# Altium schematic sheet STM32-Mentor.SchDoc: STM32 Demo板子
size A3; Author: 陈林; SheetNumber: 1; SheetTotal: 1; SPICEModelCacheTDPMXVPD: <root> / <DocumentId>TDPMXVPD</DocumentId> / <CacheFrame Number="0"> / <Model Name="cap" Kind="MDL"> / <Text>*Default semiconductor capacitor / .MODEL CAP C()</Text> / </Model> / <Model Name="xtal" Kind="CKT"> / <Text>*Generic type:crystal pkg:HC33/51 / .SUBCKT XTAL 1 2 PARAMS: FREQ=1Meg RS=750 C=13pf Q=1000 / LX 1 3 {((Q*RS)/(6.2831852*FREQ))} IC=0.5M / CX 3 4 {(1/(Q*6.2831852*FREQ*RS))} / C0 1 2 {C} / RS 4 2 {RS} / .ENDS XTAL</Text> / </Model> / <Model Name="led0" Kind="MDL"> / <Text>*Typ INFRARED GaAs LED: Vf=1.2V Vr=5V If=40mA trr=3uS / *LED Pinout: 1=A, 2=K / .MODEL LED0 D (IS=93.5P RS=84M N=2.63 BV=5 IBV=10U / + CJO=2.97P VJ=.75 M=.333 TT=4.32U)</Text> / </Model> / <Model Name="pnp" Kind="MDL"> / <Text>*Default PNP BJT / *PNP Trans Pinout: C,B,E / .MODEL PNP PNP()</Text> / </Model> / </CacheFrame> / </root>
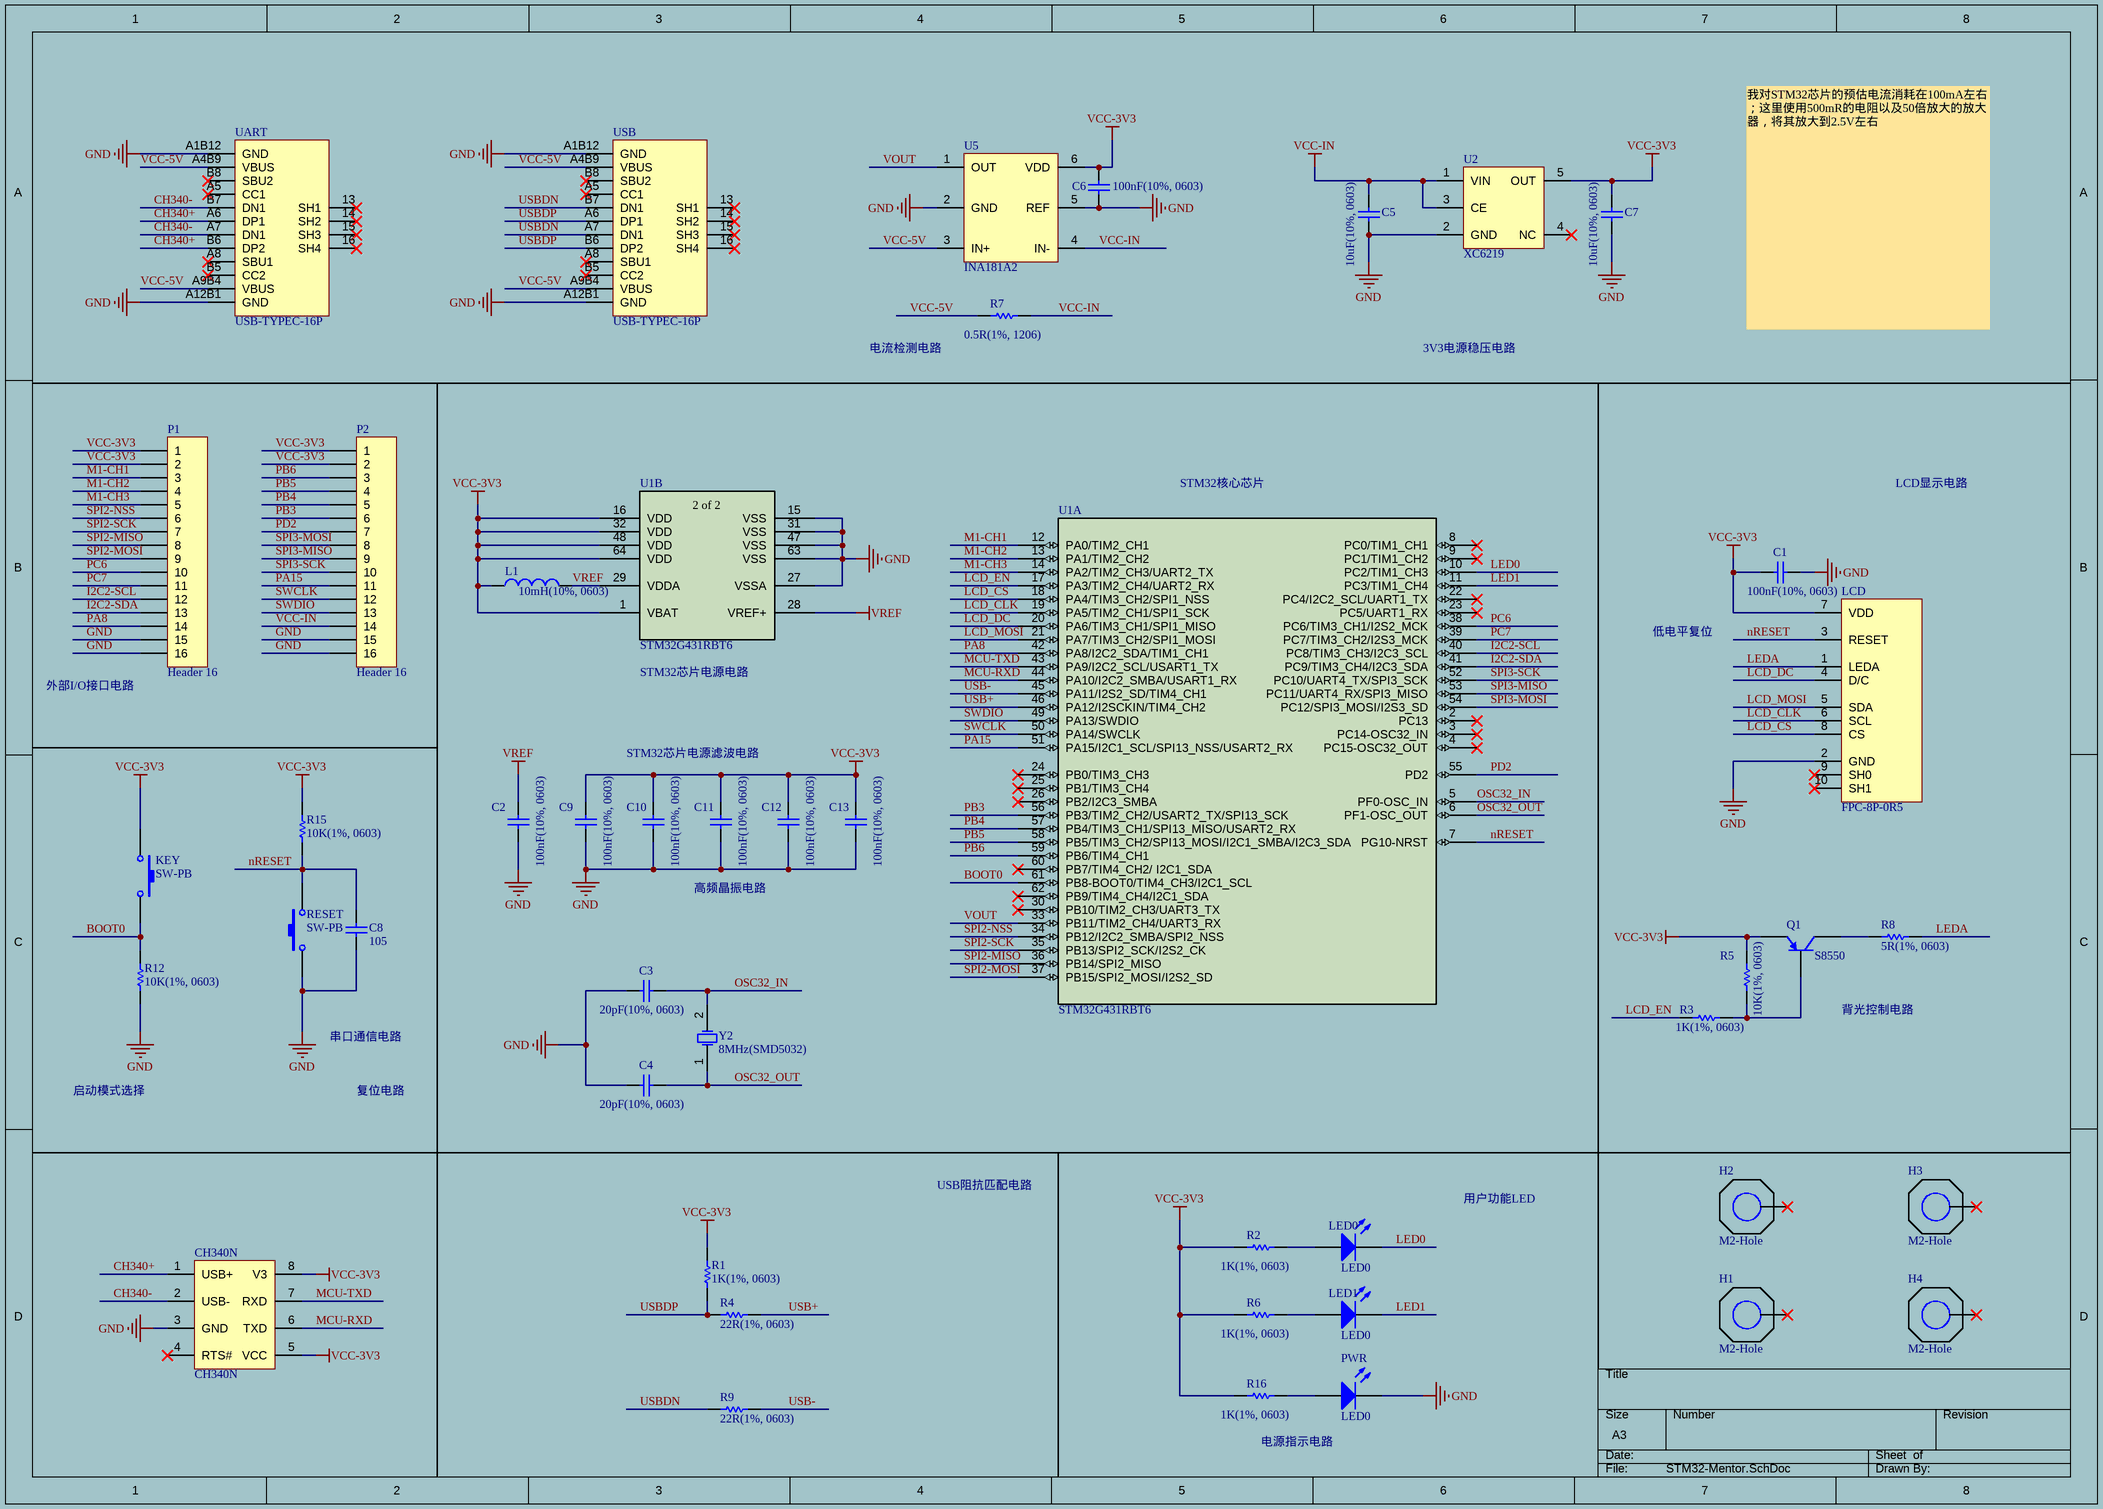
[diagram p0: STM32-Mentor.SchDoc]

## Parts
C1  100nF(10%, 0603)  [0603C]
C2  100nF(10%, 0603)  [0603C]
C3  20pF(10%, 0603)  [0603C]
C4  20pF(10%, 0603)  [0603C]
C5  10uF(10%, 0603)  [0603C]
C6  100nF(10%, 0603)  [0603C]
C7  10uF(10%, 0603)  [0603C]
C8  105  [0603C]
C9  100nF(10%, 0603)  [0603C]
C10  100nF(10%, 0603)  [0603C]
C11  100nF(10%, 0603)  [0603C]
C12  100nF(10%, 0603)  [0603C]
C13  100nF(10%, 0603)  [0603C]
CH340N  CH340N  [SOP8]
H1  M2-Hole  [M2-Hole]
H2  M2-Hole  [M2-Hole]
H3  M2-Hole  [M2-Hole]
H4  M2-Hole  [M2-Hole]
KEY  SW-PB  [SW2-4R2X3R4]
L1  value 10mH(10%, 0603)  [0805L]  (hidden comment: Inductor)
LCD  FPC-8P-0R5  [FPC-8P-0R5]
LED0  LED0  [LED-0805]
LED1  LED0  [LED-0805]
P1  Header 16  [HDR1X16]
P2  Header 16  [HDR1X16]
PWR  LED0  [LED-0805]
Q1  S8550  [SOT-23B_N]
R1  1K(1%, 0603)  [0603R]
R2  1K(1%, 0603)  [0603R]
R3  1K(1%, 0603)  [0603R]
R4  22R(1%, 0603)  [0603R]
R5  10K(1%, 0603)  [0603R]
R6  1K(1%, 0603)  [0603R]
R7  0.5R(1%, 1206)  [1206R]
R8  5R(1%, 0603)  [0603R]
R9  22R(1%, 0603)  [0603R]
R12  10K(1%, 0603)  [0603R]
R15  10K(1%, 0603)  [0603R]
R16  1K(1%, 0603)  [0603R]
RESET  SW-PB  [SW2-4R2X3R4]
U1  STM32G431RBT6  [LQFP64-10x10mm]  (parts A,B of 2)
U2  XC6219  [SOT23-5]
U5  INA181A2  [SOT23-6]
UART  USB-TYPEC-16P  [USB-TYPEC-16P]
USB  USB-TYPEC-16P  [USB-TYPEC-16P]
Y2  8MHz(SMD5032)  [SMD5032-2P]

## Nets
GND: C1.2 C2.1 C3.1 C4.1 C5.1 C6.1 C7.1 C8.1 C9.1 C10.1 C11.1 C12.1 C13.1 CH340N.3(GND) LCD.2(GND) P1.15 P1.16 P2.15 P2.16 PWR.2(K) R12.1 RESET.1 U1.15(VSS) U1.27(VSSA) U1.31(VSS) U1.47(VSS) U1.63(VSS) U2.2(GND) U5.2(GND) U5.5(REF) UART.A1B12(GND) UART.A12B1(GND) USB.A1B12(GND) USB.A12B1(GND)
VCC-3V3: C1.1 C6.2 C7.2 C9.2 C10.2 C11.2 C12.2 C13.2 CH340N.5(VCC) CH340N.8(V3) KEY.1 L1.1 LCD.7(VDD) P1.1 P1.2 P2.1 P2.2 Q1.3(E) R1.2 R2.1 R5.1 R6.1 R15.2 R16.2 U1.1(VBAT) U1.16(VDD) U1.32(VDD) U1.48(VDD) U1.64(VDD) U2.5(OUT) U5.6(VDD)
VCC-IN: C5.2 P2.14 R7.2 U2.1(VIN) U2.3(CE) U5.4(IN-)
VREF: C2.2 L1.2 U1.28(VREF+) U1.29(VDDA)
BOOT0: KEY.2 R12.2 U1.61(PB8-BOOT0/TIM4_CH3/I2C1_SCL)
CH340+: CH340N.1(USB+) UART.A6(DP1) UART.B6(DP2)
CH340-: CH340N.2(USB-) UART.A7(DN1) UART.B7(DN1)
I2C2-SCL: P1.12 U1.40(PC8/TIM3_CH3/I2C3_SCL)
I2C2-SDA: P1.13 U1.41(PC9/TIM3_CH4/I2C3_SDA)
LCD_CLK: LCD.6(SCL) U1.19(PA5/TIM2_CH1/SPI1_SCK)
LCD_CS: LCD.8(CS) U1.18(PA4/TIM3_CH2/SPI1_NSS)
LCD_DC: LCD.4(D/C) U1.20(PA6/TIM3_CH1/SPI1_MISO)
LCD_EN: R3.1 U1.17(PA3/TIM2_CH4/UART2_RX)
LCD_MOSI: LCD.5(SDA) U1.21(PA7/TIM3_CH2/SPI1_MOSI)
LED0: LED0.2(K) U1.10(PC2/TIM1_CH3)
LED1: LED1.2(K) U1.11(PC3/TIM1_CH4)
LEDA: LCD.1(LEDA) R8.2
M1-CH1: P1.3 U1.12(PA0/TIM2_CH1)
M1-CH2: P1.4 U1.13(PA1/TIM2_CH2)
M1-CH3: P1.5 U1.14(PA2/TIM2_CH3/UART2_TX)
MCU-RXD: CH340N.6(TXD) U1.44(PA10/I2C2_SMBA/USART1_RX)
MCU-TXD: CH340N.7(RXD) U1.43(PA9/I2C2_SCL/USART1_TX)
nRESET: C8.2 LCD.3(RESET) R15.1 RESET.2 U1.7(PG10-NRST)
OSC32_IN: C3.2 U1.5(PF0-OSC_IN) Y2.2(OSC2)
OSC32_OUT: C4.2 U1.6(PF1-OSC_OUT) Y2.1(OSC1)
PA8: P1.14 U1.42(PA8/I2C2_SDA/TIM1_CH1)
PA15: P2.11 U1.51(PA15/I2C1_SCL/SPI13_NSS/USART2_RX)
PB3: P2.6 U1.56(PB3/TIM2_CH2/USART2_TX/SPI13_SCK)
PB4: P2.5 U1.57(PB4/TIM3_CH1/SPI13_MISO/USART2_RX)
PB5: P2.4 U1.58(PB5/TIM3_CH2/SPI13_MOSI/I2C1_SMBA/I2C3_SDA)
PB6: P2.3 U1.59(PB6/TIM4_CH1)
PC6: P1.10 U1.38(PC6/TIM3_CH1/I2S2_MCK)
PC7: P1.11 U1.39(PC7/TIM3_CH2/I2S3_MCK)
PD2: P2.7 U1.55(PD2)
SPI2-MISO: P1.8 U1.36(PB14/SPI2_MISO)
SPI2-MOSI: P1.9 U1.37(PB15/SPI2_MOSI/I2S2_SD)
SPI2-NSS: P1.6 U1.34(PB12/I2C2_SMBA/SPI2_NSS)
SPI2-SCK: P1.7 U1.35(PB13/SPI2_SCK/I2S2_CK)
SPI3-MISO: P2.9 U1.53(PC11/UART4_RX/SPI3_MISO)
SPI3-MOSI: P2.8 U1.54(PC12/SPI3_MOSI/I2S3_SD)
SPI3-SCK: P2.10 U1.52(PC10/UART4_TX/SPI3_SCK)
SWCLK: P2.12 U1.50(PA14/SWCLK)
SWDIO: P2.13 U1.49(PA13/SWDIO)
USB+: R4.2 U1.46(PA12/I2SCKIN/TIM4_CH2)
USB-: R9.2 U1.45(PA11/I2S2_SD/TIM4_CH1)
USBDN: R9.1 USB.A7(DN1) USB.B7(DN1)
USBDP: R1.1 R4.1 USB.A6(DP1) USB.B6(DP2)
VCC-5V: R7.1 U5.3(IN+) UART.A4B9(VBUS) UART.A9B4(VBUS) USB.A4B9(VBUS) USB.A9B4(VBUS)
VOUT: U1.33(PB11/TIM2_CH4/UART3_RX) U5.1(OUT)
NetLED0_1: LED0.1(A) R2.2
NetLED1_1: LED1.1(A) R6.2
NetPWR_1: PWR.1(A) R16.1
NetQ1_1: Q1.1(C) R8.1
NetQ1_2: Q1.2(B) R3.2 R5.2

Not connected (* = marked no-connect by the designer): CH340N 4(RTS#)*; H1 0(5)*; H2 0(5)*; H3 0(5)*; H4 0(5)*; LCD 9(SH0)* 10(SH1)*; U1 2(PC13)* 3(PC14-OSC32_IN)* 4(PC15-OSC32_OUT)* 8(PC0/TIM1_CH1)* 9(PC1/TIM1_CH2)* 22(PC4/I2C2_SCL/UART1_TX)* 23(PC5/UART1_RX)* 24(PB0/TIM3_CH3)* 25(PB1/TIM3_CH4)* 26(PB2/I2C3_SMBA)* 30(PB10/TIM2_CH3/UART3_TX)* 60(PB7/TIM4_CH2/_I2C1_SDA)* 62(PB9/TIM4_CH4/I2C1_SDA)*; U2 4(NC)*; UART 13(SH1)* 14(SH2)* 15(SH3)* 16(SH4)* A5(CC1)* A8(SBU1)* B5(CC2)* B8(SBU2)*; USB 13(SH1)* 14(SH2)* 15(SH3)* 16(SH4)* A5(CC1)* A8(SBU1)* B5(CC2)* B8(SBU2)*

## Notes on the sheet
- 电流检测电路
- 3V3电源稳压电路
- 我对STM32芯片的预估电流消耗在100mA左右；这里使用500mR的电阻以及50倍放大的放大器，将其放大到2.5V左右
- STM32核心芯片
- LCD显示电路
- 低电平复位
- 外部I/O接口电路
- STM32芯片电源电路
- STM32芯片电源滤波电路
- 高频晶振电路
- 串口通信电路
- 背光控制电路
- 启动模式选择
- 复位电路
- USB阻抗匹配电路
- 用户功能LED
- 电源指示电路
- THIS DOCUMENT AND THE DATA DISCLOSED HEREIN OR
- HEREWITH IS THE PROPERTY OF ALTIUM LIMITED AND MAY
- DWG NO:
- REVISION
- REV:
- DESCRIPTION
- DATE
- APPROVED
- BE FREELY DISTRIBUTED IN WHOLE. NO RIGHTS ARE
- RESERVED OR EXPRESS OR IMPLIED WARANTEE GIVEN.
- ENG:
- APPROVALS
- PROJECT
- DSN:
- CHK:
- REFERENCE DOCUMENTS
- PROJECT REVISION:
- TITLE
- DOCUMENT REVISION:
- DESIGN ITEM:
- BOM:
- FAB DWG:
- PCB DWG:
- ASSY DWG:
- SCALE:
- A3
- SIZE
- CAGE CODE
- FILE NAME
- DWG NO.
- SHEET
- OF
- REV
- (in symbol STM32G431RBT6, part B) 2 of 2

## Library data of the parts
C1-C4 C6 C9-C13 = Cap: Capacitor; Value: 100pF; Published: 8-Jun-2000; LatestRevisionDate: 17-Jul-2002; LatestRevisionNote: Re-released for DXP Platform.; PackageReference: RAD-0.3; Publisher: Altium Limited; PackageDescription: Radial Cap, Thru-Hole; 2 Leads; 0.3 in Pin Spacing
C5 = Cap: Capacitor; Value: 104; Published: 8-Jun-2000; LatestRevisionDate: 17-Jul-2002; LatestRevisionNote: Re-released for DXP Platform.; PackageReference: RAD-0.3; Publisher: Altium Limited; PackageDescription: Radial Cap, Thru-Hole; 2 Leads; 0.3 in Pin Spacing
C7 = Cap: Capacitor; Value: 106; Published: 8-Jun-2000; LatestRevisionDate: 17-Jul-2002; LatestRevisionNote: Re-released for DXP Platform.; PackageReference: RAD-0.3; Publisher: Altium Limited; PackageDescription: Radial Cap, Thru-Hole; 2 Leads; 0.3 in Pin Spacing
C8 = Cap: Capacitor; Published: 8-Jun-2000; LatestRevisionDate: 17-Jul-2002; LatestRevisionNote: Re-released for DXP Platform.; PackageReference: RAD-0.3; Publisher: Altium Limited; PackageDescription: Radial Cap, Thru-Hole; 2 Leads; 0.3 in Pin Spacing; Value: 105
CH340N = CH340N: UART To USB
KEY RESET = SW-PB: Switch; Published: 24-Mar-1999; LatestRevisionDate: 17-Jul-2002; LatestRevisionNote: Re-released for DXP Platform.; PackageReference: SPST-2; Publisher: Altium Limited; PackageDescription: Switch; 2 Leads
L1 = Inductor: Code_IEC: 1005; Published: 8-Jun-2000; LatestRevisionDate: 29-May-2009; LatestRevisionNote: IPC-7351 Footprint Added.; PackageReference: 0402-A; Publisher: Altium Limited; PackageDescription: Chip Inductor; Code_JEITA: 0402
LED0 LED1 PWR = LED0: Typical INFRARED GaAs LED; Published: 8-Jun-2000; LatestRevisionDate: 08-Jul-2005; LatestRevisionNote: Mech Layer 1 removed.; PackageReference: LED-0; Publisher: Altium Limited; PackageDescription: LED; 2 Leads
P1 P2 = Header 16: Header, 16-Pin; LatestRevisionDate: 17-Jul-2002; LatestRevisionNote: Re-released for DXP Platform.; Publisher: Altium Limited
Q1 = PNP: PNP Bipolar Transistor; Published: 8-Jun-2000; LatestRevisionDate: 29-May-2009; LatestRevisionNote: IPC-7351 Footprint Added.; PackageVersion: Aug-1999; PackageReference: SOT-23B; Publisher: Altium Limited; PackageDescription: 3-Pin SOT-23 Package 0.95 mm Pitch, 2.4 mm Lead Span
R1-R3 R6 R16 = Res1: Resistor; Published: 8-Jun-2000; LatestRevisionDate: 17-Jul-2002; LatestRevisionNote: Re-released for DXP Platform.; PackageReference: AXIAL-0.3; Publisher: Altium Limited; PackageDescription: Axial Device, Thru-Hole; 2 Leads; 0.3 in Pin Spacing; Value: 1K
R4 R5 R7-R9 R12 R15 = Res1: Resistor; Value: 1K; Published: 8-Jun-2000; LatestRevisionDate: 17-Jul-2002; LatestRevisionNote: Re-released for DXP Platform.; PackageReference: AXIAL-0.3; Publisher: Altium Limited; PackageDescription: Axial Device, Thru-Hole; 2 Leads; 0.3 in Pin Spacing
U1 = STM32G431RBT6: No Description Available; Mfr_Name: STMicroelectronics; Copyright: Copyright (C) 2024 Ultra Librarian. All rights reserved.; Manufacturer_Part_Number: STM32G431RBT6; RefDes: RefDes; Type: DEV
U2 = XC6219: POWER: LDO regulator for 3V3
U5 = INA181A2: Amp: current amplifire
Y2 = XTAL: Crystal Oscillator; Published: 8-Jun-2000; LatestRevisionDate: 17-Jul-2002; LatestRevisionNote: Re-released for DXP Platform.; PackageReference: R38; Publisher: Altium Limited; PackageDescription: Crystal, Thru-Hole; 2 Leads; Body 3.1 x 8.2 mm (Dia.xH)